# Altium schematic sheet POWER.SchDoc
size 420 x 297 mm; SheetNumber: 3; SheetTotal: 4
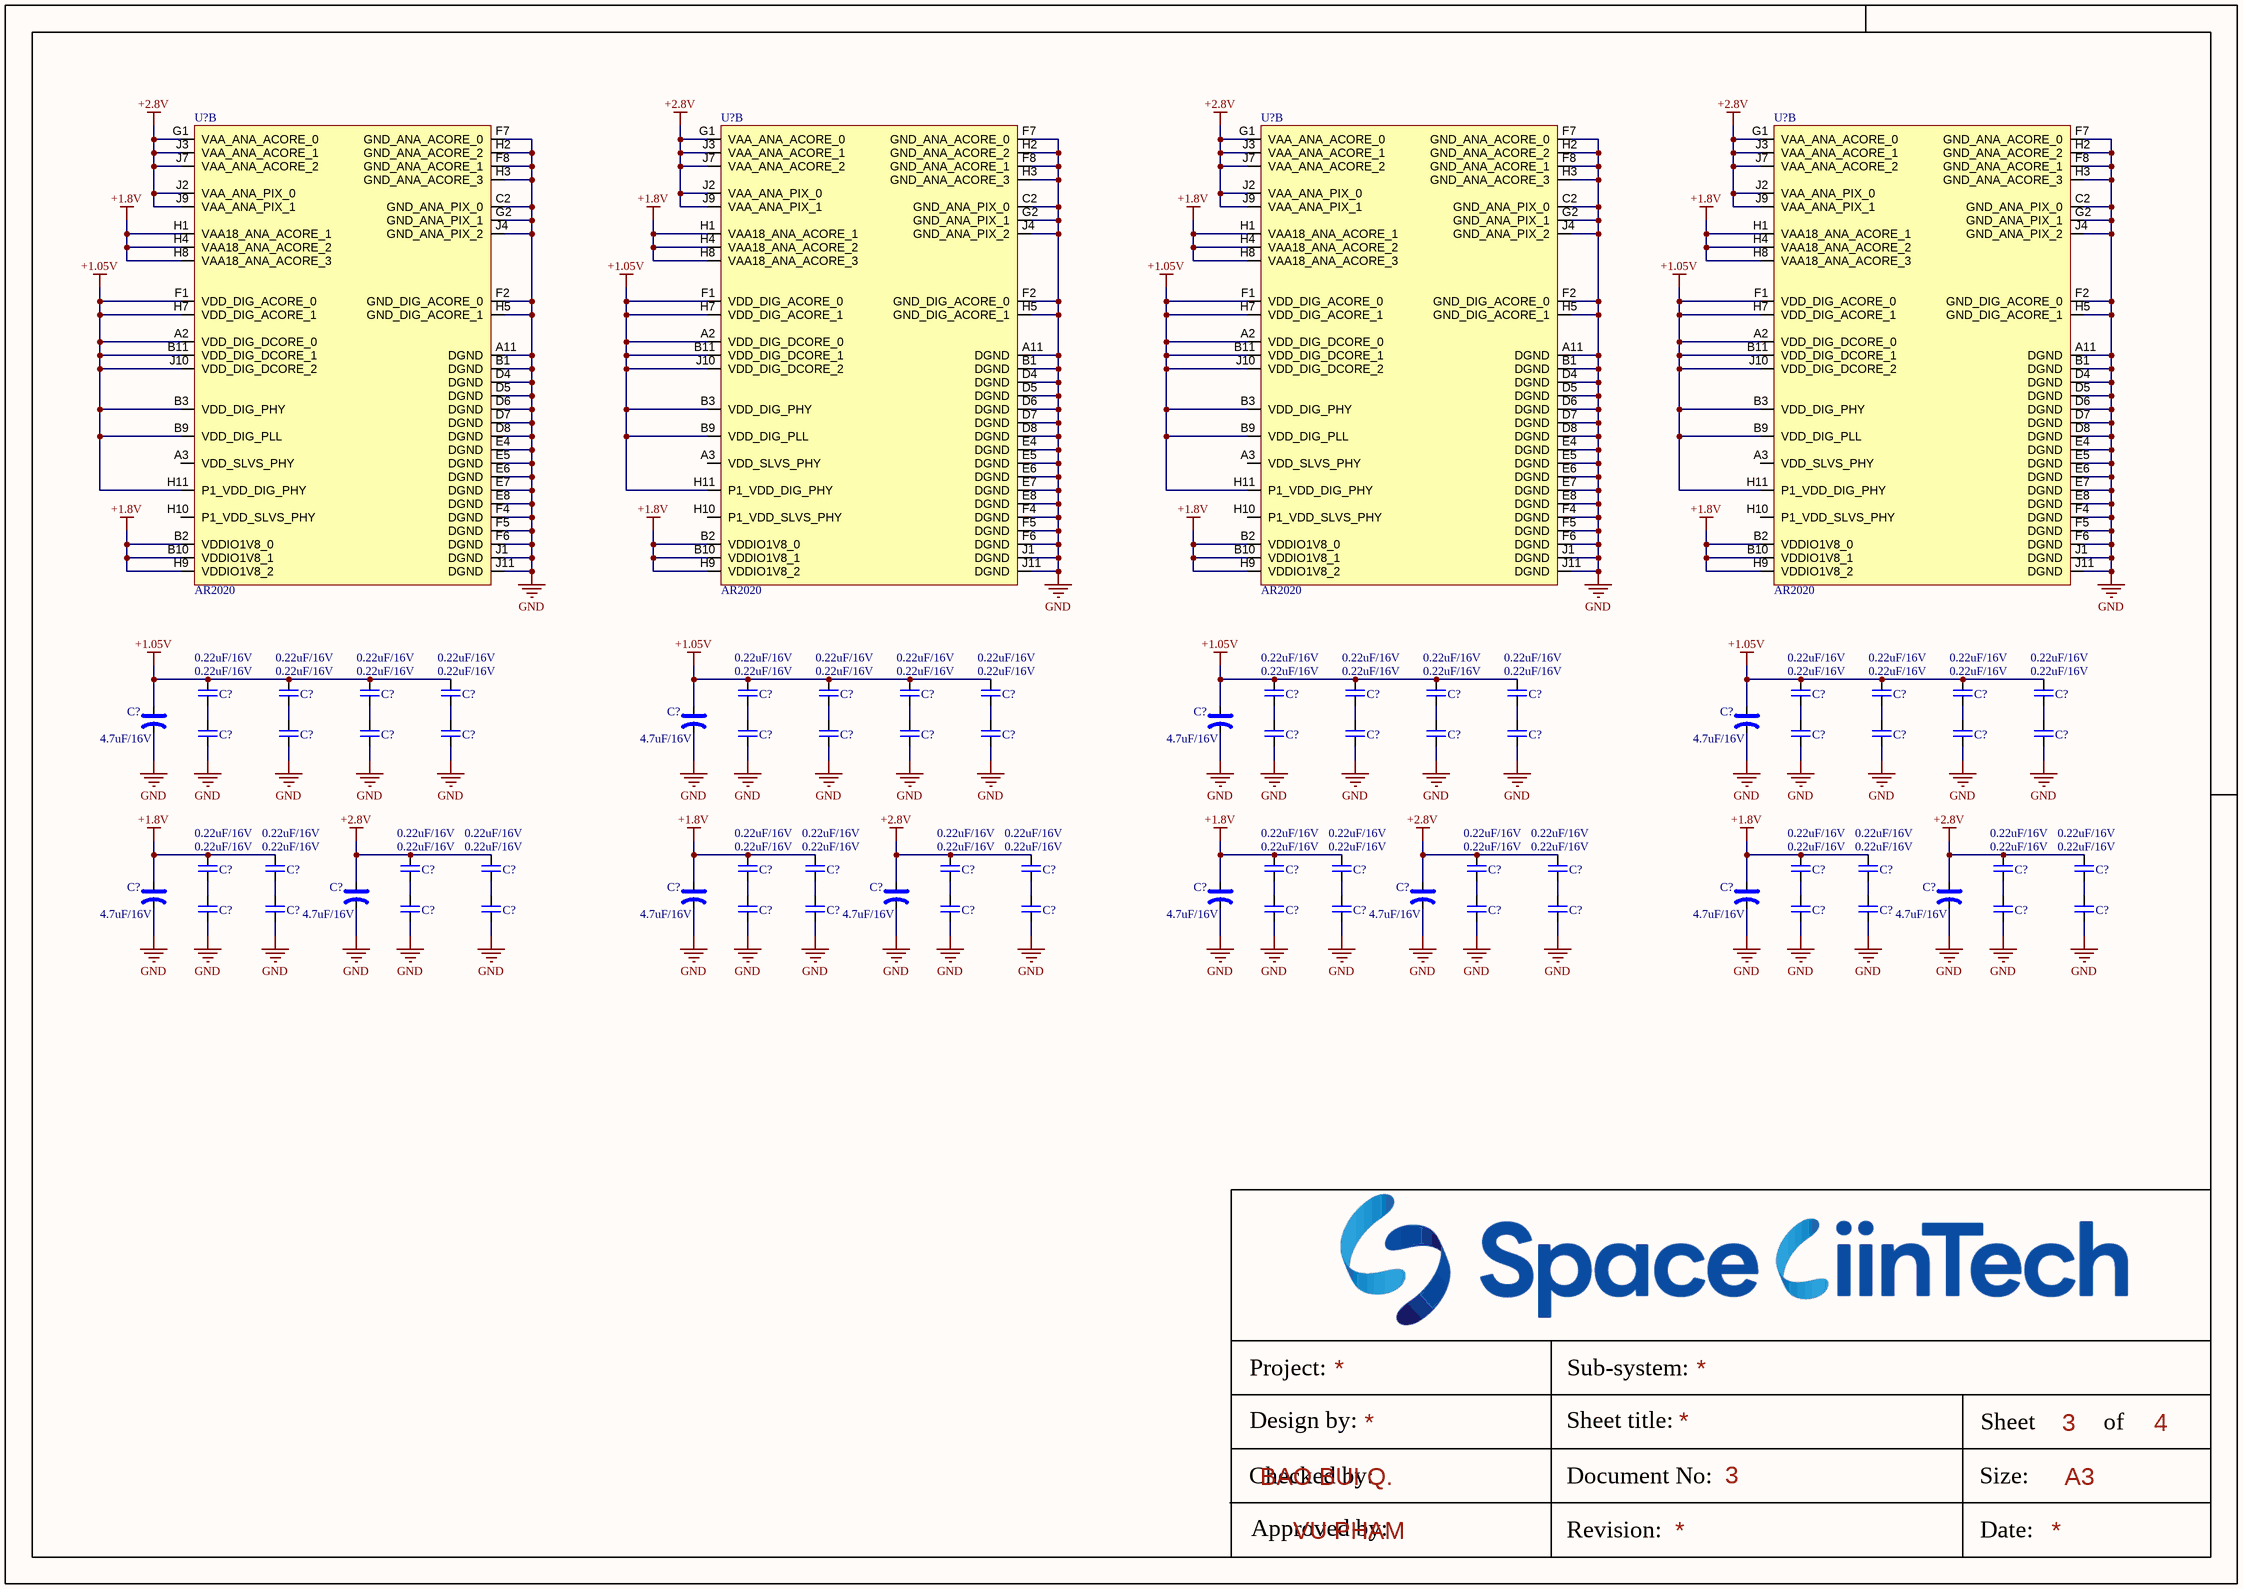
[diagram p0: POWER.SchDoc]

## Parts
(Parts that share a designator on the sheet are numbered #1, #2 ... from top to bottom, then left to right.)
C?#1  0.22uF/16V
C?#2  0.22uF/16V
C?#3  0.22uF/16V
C?#4  0.22uF/16V
C?#5  0.22uF/16V
C?#6  0.22uF/16V
C?#7  0.22uF/16V
C?#8  0.22uF/16V
C?#9  0.22uF/16V
C?#10  0.22uF/16V
C?#11  0.22uF/16V
C?#12  0.22uF/16V
C?#13  0.22uF/16V
C?#14  0.22uF/16V
C?#15  0.22uF/16V
C?#16  0.22uF/16V
C?#17  4.7uF/16V
C?#18  4.7uF/16V
C?#19  4.7uF/16V
C?#20  4.7uF/16V
C?#21  0.22uF/16V
C?#22  0.22uF/16V
C?#23  0.22uF/16V
C?#24  0.22uF/16V
C?#25  0.22uF/16V
C?#26  0.22uF/16V
C?#27  0.22uF/16V
C?#28  0.22uF/16V
C?#29  0.22uF/16V
C?#30  0.22uF/16V
C?#31  0.22uF/16V
C?#32  0.22uF/16V
C?#33  0.22uF/16V
C?#34  0.22uF/16V
C?#35  0.22uF/16V
C?#36  0.22uF/16V
C?#37  0.22uF/16V
C?#38  0.22uF/16V
C?#39  0.22uF/16V
C?#40  0.22uF/16V
C?#41  0.22uF/16V
C?#42  0.22uF/16V
C?#43  0.22uF/16V
C?#44  0.22uF/16V
C?#45  0.22uF/16V
C?#46  0.22uF/16V
C?#47  0.22uF/16V
C?#48  0.22uF/16V
C?#49  0.22uF/16V
C?#50  0.22uF/16V
C?#51  0.22uF/16V
C?#52  0.22uF/16V
C?#53  4.7uF/16V
C?#54  4.7uF/16V
C?#55  4.7uF/16V
C?#56  4.7uF/16V
C?#57  4.7uF/16V
C?#58  4.7uF/16V
C?#59  4.7uF/16V
C?#60  4.7uF/16V
C?#61  0.22uF/16V
C?#62  0.22uF/16V
C?#63  0.22uF/16V
C?#64  0.22uF/16V
C?#65  0.22uF/16V
C?#66  0.22uF/16V
C?#67  0.22uF/16V
C?#68  0.22uF/16V
C?#69  0.22uF/16V
C?#70  0.22uF/16V
C?#71  0.22uF/16V
C?#72  0.22uF/16V
C?#73  0.22uF/16V
C?#74  0.22uF/16V
C?#75  0.22uF/16V
C?#76  0.22uF/16V
U?#1  AR2020  (part B of 2)
U?#2  AR2020  (part B of 2)
U?#3  AR2020  (part B of 2)
U?#4  AR2020  (part B of 2)

## Nets
+1.05V: C?#1.2 C?#2.2 C?#3.2 C?#4.2 C?#5.2 C?#6.2 C?#7.2 C?#8.2 C?#9.2 C?#10.2 C?#11.2 C?#12.2 C?#13.2 C?#14.2 C?#15.2 C?#16.2 C?#17.1 C?#18.1 C?#19.1 C?#20.1 U?#1.A2(VDD_DIG_DCORE_0) U?#1.B3(VDD_DIG_PHY) U?#1.B9(VDD_DIG_PLL) U?#1.B11(VDD_DIG_DCORE_1) U?#1.F1(VDD_DIG_ACORE_0) U?#1.H7(VDD_DIG_ACORE_1) U?#1.H11(P1_VDD_DIG_PHY) U?#1.J10(VDD_DIG_DCORE_2) U?#2.A2(VDD_DIG_DCORE_0) U?#2.B3(VDD_DIG_PHY) U?#2.B9(VDD_DIG_PLL) U?#2.B11(VDD_DIG_DCORE_1) U?#2.F1(VDD_DIG_ACORE_0) U?#2.H7(VDD_DIG_ACORE_1) U?#2.H11(P1_VDD_DIG_PHY) U?#2.J10(VDD_DIG_DCORE_2) U?#3.A2(VDD_DIG_DCORE_0) U?#3.B3(VDD_DIG_PHY) U?#3.B9(VDD_DIG_PLL) U?#3.B11(VDD_DIG_DCORE_1) U?#3.F1(VDD_DIG_ACORE_0) U?#3.H7(VDD_DIG_ACORE_1) U?#3.H11(P1_VDD_DIG_PHY) U?#3.J10(VDD_DIG_DCORE_2) U?#4.A2(VDD_DIG_DCORE_0) U?#4.B3(VDD_DIG_PHY) U?#4.B9(VDD_DIG_PLL) U?#4.B11(VDD_DIG_DCORE_1) U?#4.F1(VDD_DIG_ACORE_0) U?#4.H7(VDD_DIG_ACORE_1) U?#4.H11(P1_VDD_DIG_PHY) U?#4.J10(VDD_DIG_DCORE_2)
+1.8V: C?#37.2 C?#38.2 C?#41.2 C?#42.2 C?#45.2 C?#46.2 C?#49.2 C?#50.2 C?#53.1 C?#55.1 C?#57.1 C?#59.1 U?#1.B2(VDDIO1V8_0) U?#1.B10(VDDIO1V8_1) U?#1.H1(VAA18_ANA_ACORE_1) U?#1.H4(VAA18_ANA_ACORE_2) U?#1.H8(VAA18_ANA_ACORE_3) U?#1.H9(VDDIO1V8_2) U?#2.B2(VDDIO1V8_0) U?#2.B10(VDDIO1V8_1) U?#2.H1(VAA18_ANA_ACORE_1) U?#2.H4(VAA18_ANA_ACORE_2) U?#2.H8(VAA18_ANA_ACORE_3) U?#2.H9(VDDIO1V8_2) U?#3.B2(VDDIO1V8_0) U?#3.B10(VDDIO1V8_1) U?#3.H1(VAA18_ANA_ACORE_1) U?#3.H4(VAA18_ANA_ACORE_2) U?#3.H8(VAA18_ANA_ACORE_3) U?#3.H9(VDDIO1V8_2) U?#4.B2(VDDIO1V8_0) U?#4.B10(VDDIO1V8_1) U?#4.H1(VAA18_ANA_ACORE_1) U?#4.H4(VAA18_ANA_ACORE_2) U?#4.H8(VAA18_ANA_ACORE_3) U?#4.H9(VDDIO1V8_2)
+2.8V: C?#39.2 C?#40.2 C?#43.2 C?#44.2 C?#47.2 C?#48.2 C?#51.2 C?#52.2 C?#54.1 C?#56.1 C?#58.1 C?#60.1 U?#1.G1(VAA_ANA_ACORE_0) U?#1.J2(VAA_ANA_PIX_0) U?#1.J3(VAA_ANA_ACORE_1) U?#1.J7(VAA_ANA_ACORE_2) U?#1.J9(VAA_ANA_PIX_1) U?#2.G1(VAA_ANA_ACORE_0) U?#2.J2(VAA_ANA_PIX_0) U?#2.J3(VAA_ANA_ACORE_1) U?#2.J7(VAA_ANA_ACORE_2) U?#2.J9(VAA_ANA_PIX_1) U?#3.G1(VAA_ANA_ACORE_0) U?#3.J2(VAA_ANA_PIX_0) U?#3.J3(VAA_ANA_ACORE_1) U?#3.J7(VAA_ANA_ACORE_2) U?#3.J9(VAA_ANA_PIX_1) U?#4.G1(VAA_ANA_ACORE_0) U?#4.J2(VAA_ANA_PIX_0) U?#4.J3(VAA_ANA_ACORE_1) U?#4.J7(VAA_ANA_ACORE_2) U?#4.J9(VAA_ANA_PIX_1)
GND: C?#17.2 C?#18.2 C?#19.2 C?#20.2 C?#21.1 C?#22.1 C?#23.1 C?#24.1 C?#25.1 C?#26.1 C?#27.1 C?#28.1 C?#29.1 C?#30.1 C?#31.1 C?#32.1 C?#33.1 C?#34.1 C?#35.1 C?#36.1 C?#53.2 C?#54.2 C?#55.2 C?#56.2 C?#57.2 C?#58.2 C?#59.2 C?#60.2 C?#61.1 C?#62.1 C?#63.1 C?#64.1 C?#65.1 C?#66.1 C?#67.1 C?#68.1 C?#69.1 C?#70.1 C?#71.1 C?#72.1 C?#73.1 C?#74.1 C?#75.1 C?#76.1 U?#1.A11(DGND) U?#1.B1(DGND) U?#1.C2(GND_ANA_PIX_0) U?#1.D4(DGND) U?#1.D5(DGND) U?#1.D6(DGND) U?#1.D7(DGND) U?#1.D8(DGND) U?#1.E4(DGND) U?#1.E5(DGND) U?#1.E6(DGND) U?#1.E7(DGND) U?#1.E8(DGND) U?#1.F2(GND_DIG_ACORE_0) U?#1.F4(DGND) U?#1.F5(DGND) U?#1.F6(DGND) U?#1.F7(GND_ANA_ACORE_0) U?#1.F8(GND_ANA_ACORE_1) U?#1.G2(GND_ANA_PIX_1) U?#1.H2(GND_ANA_ACORE_2) U?#1.H3(GND_ANA_ACORE_3) U?#1.H5(GND_DIG_ACORE_1) U?#1.J1(DGND) U?#1.J4(GND_ANA_PIX_2) U?#1.J11(DGND) U?#2.A11(DGND) U?#2.B1(DGND) U?#2.C2(GND_ANA_PIX_0) U?#2.D4(DGND) U?#2.D5(DGND) U?#2.D6(DGND) U?#2.D7(DGND) U?#2.D8(DGND) U?#2.E4(DGND) U?#2.E5(DGND) U?#2.E6(DGND) U?#2.E7(DGND) U?#2.E8(DGND) U?#2.F2(GND_DIG_ACORE_0) U?#2.F4(DGND) U?#2.F5(DGND) U?#2.F6(DGND) U?#2.F7(GND_ANA_ACORE_0) U?#2.F8(GND_ANA_ACORE_1) U?#2.G2(GND_ANA_PIX_1) U?#2.H2(GND_ANA_ACORE_2) U?#2.H3(GND_ANA_ACORE_3) U?#2.H5(GND_DIG_ACORE_1) U?#2.J1(DGND) U?#2.J4(GND_ANA_PIX_2) U?#2.J11(DGND) U?#3.A11(DGND) U?#3.B1(DGND) U?#3.C2(GND_ANA_PIX_0) U?#3.D4(DGND) U?#3.D5(DGND) U?#3.D6(DGND) U?#3.D7(DGND) U?#3.D8(DGND) U?#3.E4(DGND) U?#3.E5(DGND) U?#3.E6(DGND) U?#3.E7(DGND) U?#3.E8(DGND) U?#3.F2(GND_DIG_ACORE_0) U?#3.F4(DGND) U?#3.F5(DGND) U?#3.F6(DGND) U?#3.F7(GND_ANA_ACORE_0) U?#3.F8(GND_ANA_ACORE_1) U?#3.G2(GND_ANA_PIX_1) U?#3.H2(GND_ANA_ACORE_2) U?#3.H3(GND_ANA_ACORE_3) U?#3.H5(GND_DIG_ACORE_1) U?#3.J1(DGND) U?#3.J4(GND_ANA_PIX_2) U?#3.J11(DGND) U?#4.A11(DGND) U?#4.B1(DGND) U?#4.C2(GND_ANA_PIX_0) U?#4.D4(DGND) U?#4.D5(DGND) U?#4.D6(DGND) U?#4.D7(DGND) U?#4.D8(DGND) U?#4.E4(DGND) U?#4.E5(DGND) U?#4.E6(DGND) U?#4.E7(DGND) U?#4.E8(DGND) U?#4.F2(GND_DIG_ACORE_0) U?#4.F4(DGND) U?#4.F5(DGND) U?#4.F6(DGND) U?#4.F7(GND_ANA_ACORE_0) U?#4.F8(GND_ANA_ACORE_1) U?#4.G2(GND_ANA_PIX_1) U?#4.H2(GND_ANA_ACORE_2) U?#4.H3(GND_ANA_ACORE_3) U?#4.H5(GND_DIG_ACORE_1) U?#4.J1(DGND) U?#4.J4(GND_ANA_PIX_2) U?#4.J11(DGND)
NetC?#1_1: C?#1.1 C?#21.2
NetC?#2_1: C?#2.1 C?#22.2
NetC?#3_1: C?#3.1 C?#23.2
NetC?#4_1: C?#4.1 C?#24.2
NetC?#5_1: C?#5.1 C?#25.2
NetC?#6_1: C?#6.1 C?#26.2
NetC?#7_1: C?#7.1 C?#27.2
NetC?#8_1: C?#8.1 C?#28.2
NetC?#9_1: C?#9.1 C?#29.2
NetC?#10_1: C?#10.1 C?#30.2
NetC?#11_1: C?#11.1 C?#31.2
NetC?#12_1: C?#12.1 C?#32.2
NetC?#13_1: C?#13.1 C?#33.2
NetC?#14_1: C?#14.1 C?#34.2
NetC?#15_1: C?#15.1 C?#35.2
NetC?#16_1: C?#16.1 C?#36.2
NetC?#37_1: C?#37.1 C?#61.2
NetC?#38_1: C?#38.1 C?#62.2
NetC?#39_1: C?#39.1 C?#63.2
NetC?#40_1: C?#40.1 C?#64.2
NetC?#41_1: C?#41.1 C?#65.2
NetC?#42_1: C?#42.1 C?#66.2
NetC?#43_1: C?#43.1 C?#67.2
NetC?#44_1: C?#44.1 C?#68.2
NetC?#45_1: C?#45.1 C?#69.2
NetC?#46_1: C?#46.1 C?#70.2
NetC?#47_1: C?#47.1 C?#71.2
NetC?#48_1: C?#48.1 C?#72.2
NetC?#49_1: C?#49.1 C?#73.2
NetC?#50_1: C?#50.1 C?#74.2
NetC?#51_1: C?#51.1 C?#75.2
NetC?#52_1: C?#52.1 C?#76.2

Not connected (* = marked no-connect by the designer): U?#1 A3(VDD_SLVS_PHY) H10(P1_VDD_SLVS_PHY); U?#2 A3(VDD_SLVS_PHY) H10(P1_VDD_SLVS_PHY); U?#3 A3(VDD_SLVS_PHY) H10(P1_VDD_SLVS_PHY); U?#4 A3(VDD_SLVS_PHY) H10(P1_VDD_SLVS_PHY)

## Notes on the sheet
- Project:
- Sub-system:
- Design by:
- BAO BUI Q.
- Sheet title:
- Sheet
- A3
- of
- Checked by:
- Approved by:
- VU PHAM
- Revision:
- Document No:
- Size:
- Date:

## Library data of the parts
C?#1-C?#16 C?#21-C?#52 C?#61-C?#76 = CAP_SMD: CAP_Chip; Value: 33pF
C?#17-C?#20 C?#53-C?#60 = CAP_TH: CAP_Polarization; Published: 8-Jun-2000; LatestRevisionDate: 17-Jul-2002; LatestRevisionNote: Re-released for DXP Platform.; PackageReference: POLAR0.8; Publisher: Altium Limited